# Altium schematic sheet atmega128rf.SchDoc: Microcontroller
size A3; CheckedBy: rrodrigu; Author: Satxo; CompanyName: Satxo; Revision: 0v1; SheetNumber: 3; SheetTotal: 8; ProjectName: Basesation
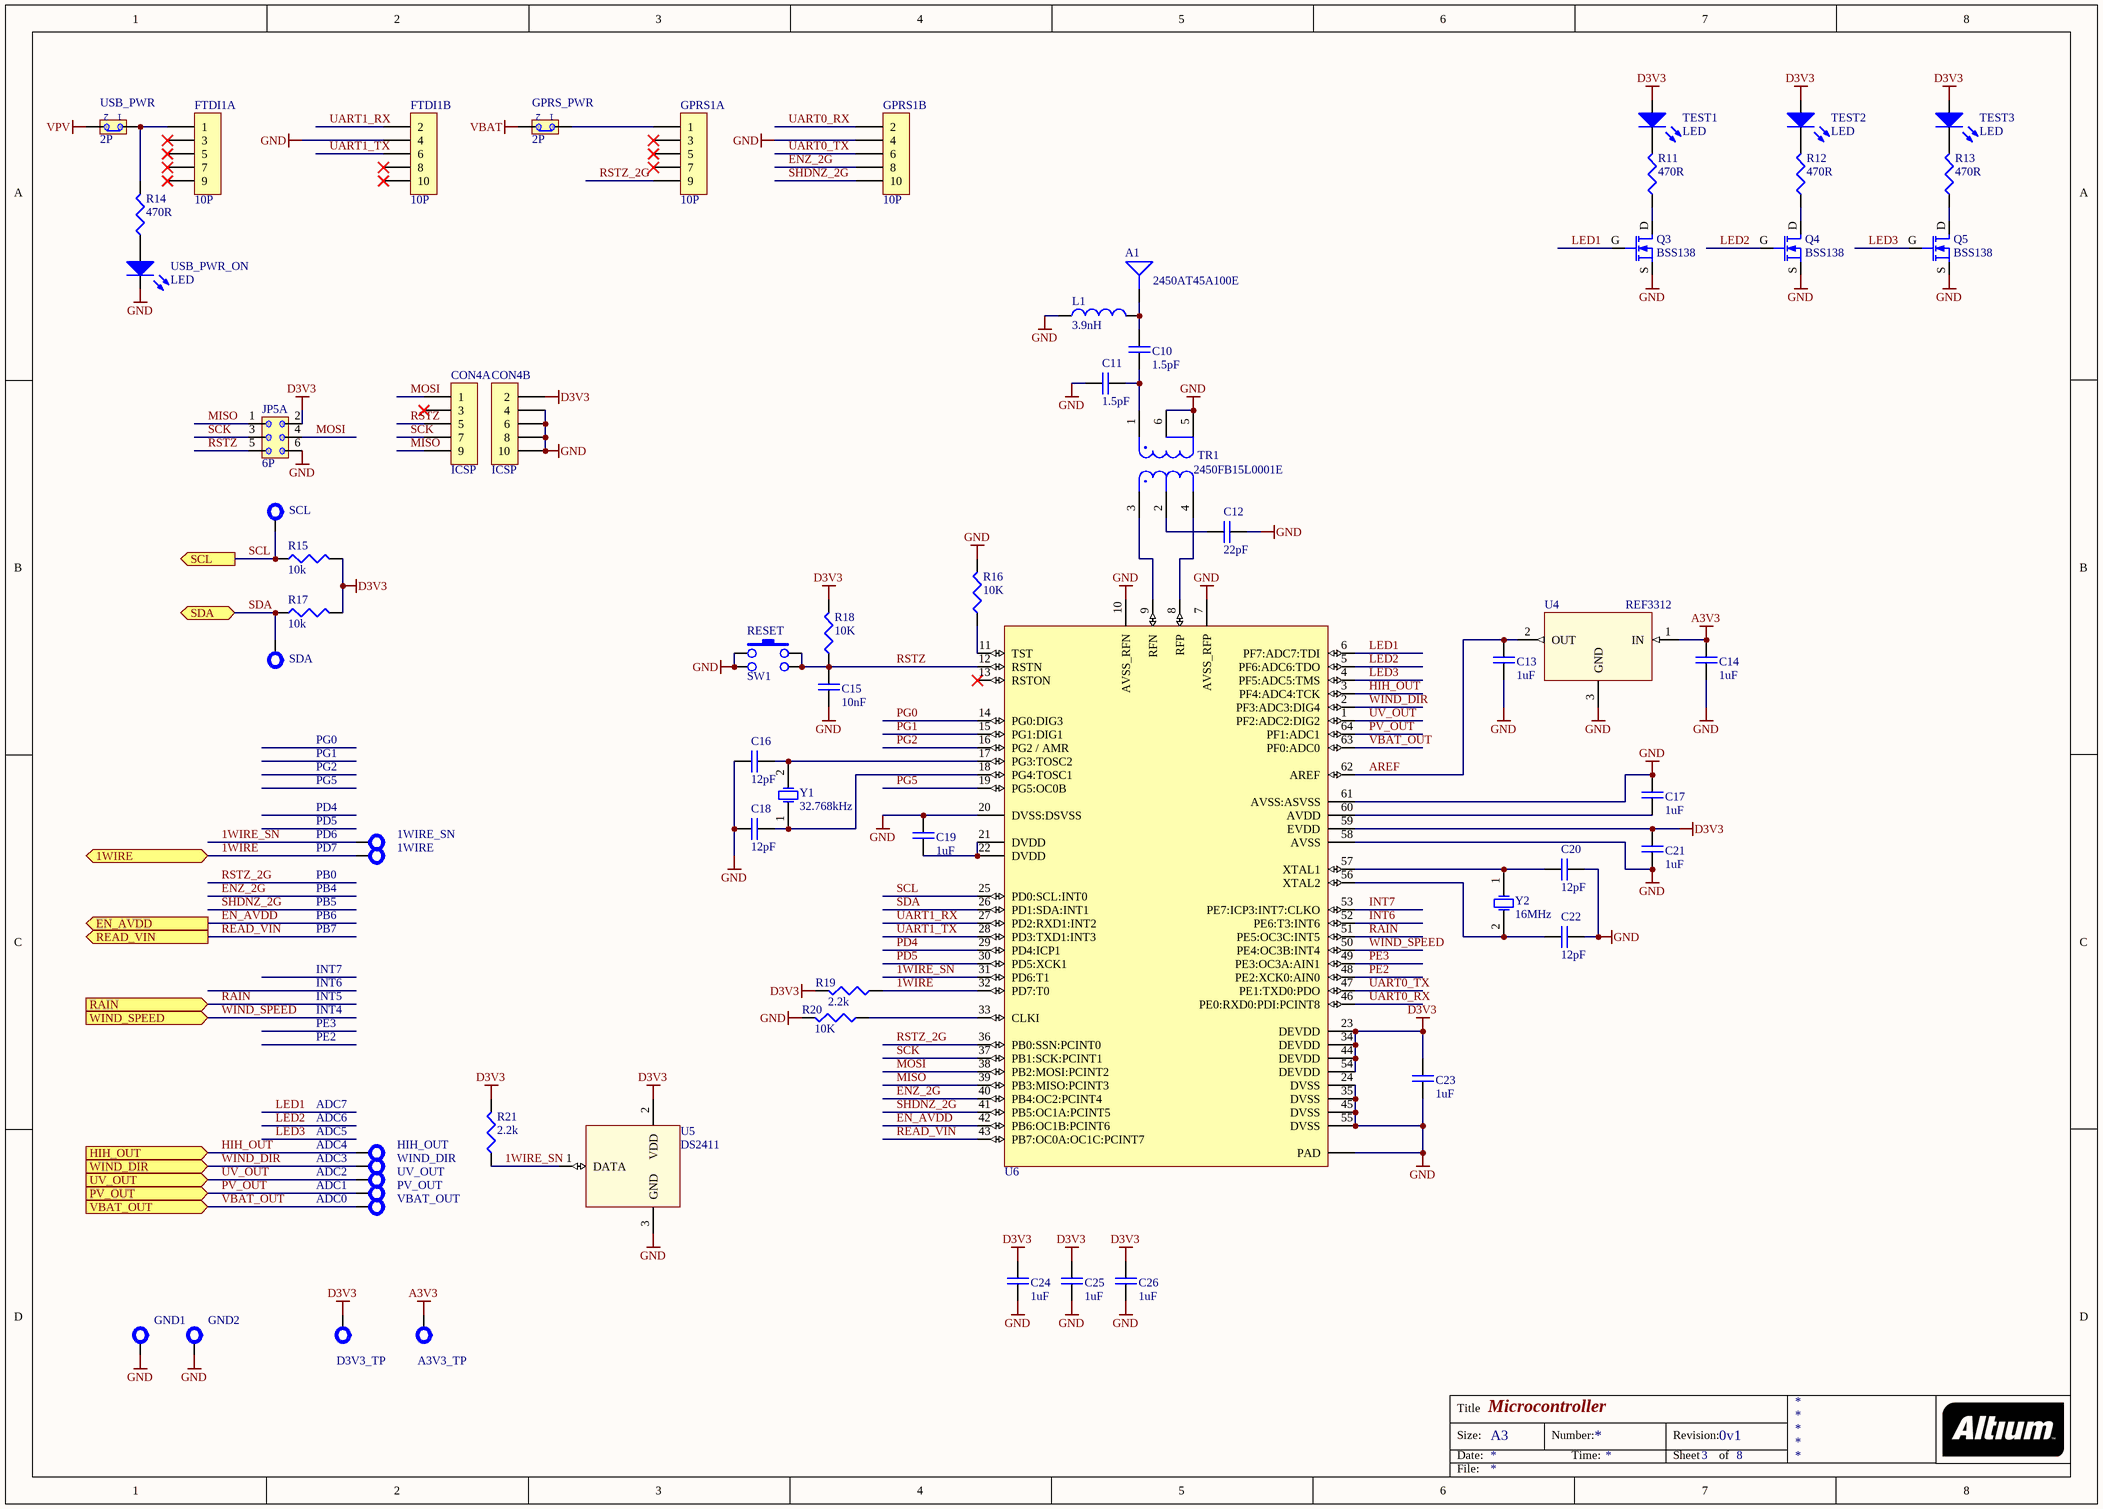
[diagram p0: atmega128rf.SchDoc]

## Parts
1WIRE  Test Point  [TERMINAL]  (value not drawn)  (no BOM)
1WIRE_SN  Test Point  [TERMINAL]  (value not drawn)  (no BOM)
A1  2450AT45A100E  [2450AT45A100E]
A3V3_TP  Test Point  [TERMINAL]  (value not drawn)  (no BOM)
C10  1.5pF  [0402]
C11  1.5pF  [0402]
C12  22pF  [0402]
C13  1uF  [0603]
C14  1uF  [0603]
C15  10nF  [0603]
C16  12pF  [0603]
C17  1uF  [0603]
C18  12pF  [0603]
C19  1uF  [0603]
C20  12pF  [0603]
C21  1uF  [0603]
C22  12pF  [0603]
C23  1uF  [0603]
C24  1uF  [0603]
C25  1uF  [0603]
C26  1uF  [0603]
CON4  ICSP  [IDC-10-F]  (parts A,B of 2)
D3V3_TP  Test Point  [TERMINAL]  (value not drawn)  (no BOM)
FTDI1  10P  [IDC-10-90]  (parts A,B of 2)
GND1  Test Point  [TEST-PROBE2]  (value not drawn)  (no BOM)
GND2  Test Point  [TEST-PROBE2]  (value not drawn)  (no BOM)
GPRS1  10P  [IDC-10-90]  (parts A,B of 2)
GPRS_PWR  2P  [SIP-2]
HIH_OUT  Test Point  [TERMINAL]  (value not drawn)  (no BOM)
JP5  6P  [DIL-6]  (part A of 3)
L1  3.9nH  [0402]
PV_OUT  Test Point  [TERMINAL]  (value not drawn)  (no BOM)
Q3  BSS138  [SOT-23@GSD]
Q4  BSS138  [SOT-23@GSD]
Q5  BSS138  [SOT-23@GSD]
R11  470R  [0603]
R12  470R  [0603]
R13  470R  [0603]
R14  470R  [0603]
R15  10k  [0603]
R16  10K  [0603]
R17  10k  [0603]
R18  10K  [0603]
R19  2.2k  [0603]
R20  10K  [0603]
R21  2.2k  [0603]
RESET  SW1  [MICROSWITCH]
SCL  Test Point  [TERMINAL]  (value not drawn)  (no BOM)
SDA  Test Point  [TERMINAL]  (value not drawn)  (no BOM)
TEST1  LED  [0805@DIODE]
TEST2  LED  [0805@DIODE]
TEST3  LED  [0805@DIODE]
TR1  2450FB15L0001E  [0805@BALUN]
U4  REF3312  [SOT-23]
U5  DS2411  [SOT-23]
U6  ATmega128RFA1  [QFN-64@EP]  (value not drawn)
USB_PWR  2P  [SIP-2]
USB_PWR_ON  LED  [0805@DIODE]
UV_OUT  Test Point  [TERMINAL]  (value not drawn)  (no BOM)
VBAT_OUT  Test Point  [TERMINAL]  (value not drawn)  (no BOM)
WIND_DIR  Test Point  [TERMINAL]  (value not drawn)  (no BOM)
Y1  32.768kHz  [HC-49U]
Y2  16MHz  [HC-49U]

## Ports
1WIRE (bidir), EN_AVDD (out), HIH_OUT (in), PV_OUT (in), RAIN (in), READ_VIN (out), SCL (out), SDA (bidir), UV_OUT (in), VBAT_OUT (in), WIND_DIR (in), WIND_SPEED (in)

## Nets
A3V3: A3V3_TP.1(TP) C14.1 U4.1(IN)
D3V3: C21.2 C23.2 C24.2 C25.2 C26.2 CON4.2 D3V3_TP.1(TP) JP5.2 R15.2 R17.2 R18.2 R19.2 R21.2 TEST1.A TEST2.A TEST3.A U5.2(VDD) U6.23(DEVDD) U6.34(DEVDD) U6.44(DEVDD) U6.54(DEVDD) U6.59(EVDD)
GND: C11.1 C12.2 C13.2 C14.2 C15.2 C16.1 C17.2 C18.1 C19.2 C20.2 C21.1 C22.2 C23.1 C24.1 C25.1 C26.1 CON4.4 CON4.6 CON4.8 CON4.10 FTDI1.4 GND1.1(TP) GND2.1(TP) GPRS1.4 JP5.6 L1.1 Q3.S Q4.S Q5.S R16.2 R20.2 RESET.1 RESET.3 TR1.5(Ground) TR1.6(Ground) U4.3(GND) U5.3(GND) U6.7(AVSS_RFP) U6.10(AVSS_RFN) U6.20(DVSS:DSVSS) U6.24(DVSS) U6.35(DVSS) U6.45(DVSS) U6.55(DVSS) U6.58(AVSS) U6.61(AVSS:ASVSS) U6.PAD USB_PWR_ON.K
VBAT: GPRS_PWR.2
VPV: USB_PWR.2
1WIRE: 1WIRE.1(TP) R19.1 U6.32(PD7:T0) ; port 1WIRE
1WIRE_SN: 1WIRE_SN.1(TP) R21.1 U5.1(DATA) U6.31(PD6:T1)
AREF: C13.1 U4.2(OUT) U6.62(AREF)
EN_AVDD: U6.42(PB6:OC1B:PCINT6) ; port EN_AVDD
ENZ_2G: GPRS1.8 U6.40(PB4:OC2:PCINT4)
HIH_OUT: HIH_OUT.1(TP) U6.3(PF4:ADC4:TCK) ; port HIH_OUT
INT6: U6.52(PE6:T3:INT6)
INT7: U6.53(PE7:ICP3:INT7:CLKO)
LED1: Q3.G U6.6(PF7:ADC7:TDI)
LED2: Q4.G U6.5(PF6:ADC6:TDO)
LED3: Q5.G U6.4(PF5:ADC5:TMS)
MISO: CON4.9 JP5.1 U6.39(PB3:MISO:PCINT3)
MOSI: CON4.1 JP5.4 U6.38(PB2:MOSI:PCINT2)
PD4: U6.29(PD4:ICP1)
PD5: U6.30(PD5:XCK1)
PE2: U6.48(PE2:XCK0:AIN0)
PE3: U6.49(PE3:OC3A:AIN1)
PG0: U6.14(PG0:DIG3)
PG1: U6.15(PG1:DIG1)
PG2: U6.16(PG2_/_AMR)
PG5: U6.19(PG5:OC0B)
PV_OUT: PV_OUT.1(TP) U6.64(PF1:ADC1) ; port PV_OUT
RAIN: U6.51(PE5:OC3C:INT5) ; port RAIN
READ_VIN: U6.43(PB7:OC0A:OC1C:PCINT7) ; port READ_VIN
RSTZ: C15.1 CON4.5 JP5.5 R18.1 RESET.2 RESET.4 U6.12(RSTN)
RSTZ_2G: GPRS1.9 U6.36(PB0:SSN:PCINT0)
SCK: CON4.7 JP5.3 U6.37(PB1:SCK:PCINT1)
SCL: R15.1 SCL.1(TP) U6.25(PD0:SCL:INT0) ; port SCL
SDA: R17.1 SDA.1(TP) U6.26(PD1:SDA:INT1) ; port SDA
SHDNZ_2G: GPRS1.10 U6.41(PB5:OC1A:PCINT5)
UART0_RX: GPRS1.2 U6.46(PE0:RXD0:PDI:PCINT8)
UART0_TX: GPRS1.6 U6.47(PE1:TXD0:PDO)
UART1_RX: FTDI1.2 U6.27(PD2:RXD1:INT2)
UART1_TX: FTDI1.6 U6.28(PD3:TXD1:INT3)
UV_OUT: U6.1(PF2:ADC2:DIG2) UV_OUT.1(TP) ; port UV_OUT
VBAT_OUT: U6.63(PF0:ADC0) VBAT_OUT.1(TP) ; port VBAT_OUT
WIND_DIR: U6.2(PF3:ADC3:DIG4) WIND_DIR.1(TP) ; port WIND_DIR
WIND_SPEED: U6.50(PE4:OC3B:INT4) ; port WIND_SPEED
NetA1_1: A1.1 C10.2 L1.2
NetC10_1: C10.1 C11.2 TR1.1(Unbalanced_Port)
NetC12_1: C12.1 TR1.2(DC_Feed_+_RF_GND)
NetC16_2: C16.2 U6.17(PG3:TOSC2) Y1.2(OSC2)
NetC17_1: C17.1 U6.60(AVDD)
NetC18_2: C18.2 U6.18(PG4:TOSC1) Y1.1(OSC1)
NetC19_1: C19.1 U6.21(DVDD) U6.22(DVDD)
NetC20_1: C20.1 U6.57(XTAL1) Y2.1(OSC1)
NetC22_1: C22.1 U6.56(XTAL2) Y2.2(OSC2)
NetFTDI1_1: FTDI1.1 R14.2 USB_PWR.1
NetGPRS1_1: GPRS1.1 GPRS_PWR.1
NetQ3_D: Q3.D R11.1
NetQ4_D: Q4.D R12.1
NetQ5_D: Q5.D R13.1
NetR11_2: R11.2 TEST1.K
NetR12_2: R12.2 TEST2.K
NetR13_2: R13.2 TEST3.K
NetR14_1: R14.1 USB_PWR_ON.A
NetR16_1: R16.1 U6.11(TST)
NetR20_1: R20.1 U6.33(CLKI)
NetTR1_3: TR1.3(Balanced_Port) U6.9(RFN)
NetTR1_4: TR1.4(Balanced_Port) U6.8(RFP)

Not connected (* = marked no-connect by the designer): CON4 3*; FTDI1 3* 5* 7* 8* 9* 10*; GPRS1 3* 5* 7*; U6 13(RSTON)*

## Notes on the sheet
- PG0
- PG1
- PG2
- PG5
- PD4
- PD5
- PD6
- PD7
- PB0
- PB4
- PB5
- PB6
- INT6
- INT7
- PB7
- PE2
- PE3
- INT4
- INT5
- ADC6
- ADC7
- ADC1
- ADC2
- ADC3
- ADC4
- ADC5
- ADC0
- Title
- Size:
- Date:
- A3
- Number:
- Time:
- Revision:
- Sheet
- of
- File:

## Library data of the parts
1WIRE 1WIRE_SN A3V3_TP GND1 GND2 HIH_OUT PV_OUT SCL SDA UV_OUT VBAT_OUT WIND_DIR = TEST-PROBE: Test/Probe Point; Owner: Nuno Brum; Sub-Type: Mechanical; Assembly: PCB; Validation Date: 2006-05-15; Type: PCB; Creation Date: 2005-06-01; Status: Valid
A1 = Antenna SE: ANTENNA
C10-C26 = CAP: Capacitor; Owner: Nuno Brum; Sub-Type: Ceramic; Assembly: INS; Maximum Voltage: *; Creation Date: 2005-04-28; Status: Valid; Validation date: 2006-05-15; Type: Capacitor
CON4 FTDI1 GPRS1 = CON10: Connector 10 Pins; Owner: António Silva; Assembly: INS; Sub-Type: Connector; Creation Date: 2005-11-21; Status: Valid; Validation Date: 2006-05-15; Type: Electrical & Mechanical
D3V3_TP = TEST-PROBE: Test/Probe Point; Owner: Nuno Brum; Type: PCB; Sub-Type: Mechanical; Validation Date: 2006-05-15; Creation Date: 2005-06-01; Status: Valid; Assembly: PCB
GPRS_PWR USB_PWR = JMP2: 2-pin Jumper; Owner: Nuno Brum; Sub-Type: Connector; STATE1: 1; Assembly: INS; Validation Date: 2006-05-15; Creation Date: 2002-07-17; Status: Valid; Type: Electrical & Mechanical
JP5 = JMP6: 6-Pin Jumper; Sub-Type: Connector; Owner: Rui Rebelo; Assembly: INS; Creation Date: 2005-07-17; Status: Valid; Validation Date: 2006-05-15; Type: Electrical & Mechanical
L1 = IND: Inductor; Owner: Nuno Brum; Sub-Type: Generic; Assembly: INS; Validation date: 2006-05-15; Creation Date: 2002-07-17; Status: Valid; Type: Inductor
Q3-Q5 = MOSFET-N: N-Channel Logic Level Enhancement Mode Field Effect Transistor; pin to pad: 2>3 3>2; Owner: Nuno Brum; Sub-Type: MOSFET; Assembly: INS; Creation Date: 2001-06-05; Status: Valid; Model: BSS138; Type: Transistor
R11-R21 = RES: Resistor; Owner: Nuno Brum; Sub-Type: Generic; Assembly: INS; Validation date: 2006-05-15; Creation Date: 2002-07-17; Status: Valid; Power: *; Type: Resistor
RESET = SW1: Switch Push Button; Owner: Nuno Brum; Assembly: INS; Validation Date: 2006-05-15; Sub-Type: Switch; Creation Date: 2002-07-17; Status: Valid; Type: Electrical & Mechanical
TEST1-TEST3 USB_PWR_ON = LED: Light emitting diode; Owner: Nuno Brum; Assembly: INS; Creation Date: 2001-06-05; Sub-Type: LED; Status: Valid; Validation date: 2006-05-15; Model: LED; Type: Diode
TR1 = 2450FB15L0001E: FILTER BALUN ATMEL 2.45GHZ; Owner: Rui Rebelo; Sub-Type: Transformer; Type: Electrical & Mechanical; Assembly: INS; Creation Date: 2002-07-25; Status: New
U4 = REF3312: Voltage Reference 1.25V, 30ppm/degC, 5mA; Type: IC; Creation Date: 2012-12-09
U5 = DS2411: Silicon Serial Number; Type: IC; Creation Date: 2012-12-10
U6 = ATmega128RFA1: 802.15.4 compliant AVR transceiver; verified by: vlarsen; verified date: 2010-12-05; Status: Verified
Y1 Y2 = Crystal Oscillator: Published: 17-Jul-2002; DatasheetDocument: 18-Apr-2000; PackageReference: CSM-7; Publisher: Altium Limited; ComponentLink1Description: Manufacturer Link; ComponentLink1URL: http://www.ecsxtal.com/; ComponentLink2Description: Datasheet; ComponentLink2URL: http://www.ecsxtal.com/pdf3/CSM_7.pdf